# EAGLE design EnsembleSix (EAGLE 7.6.0)
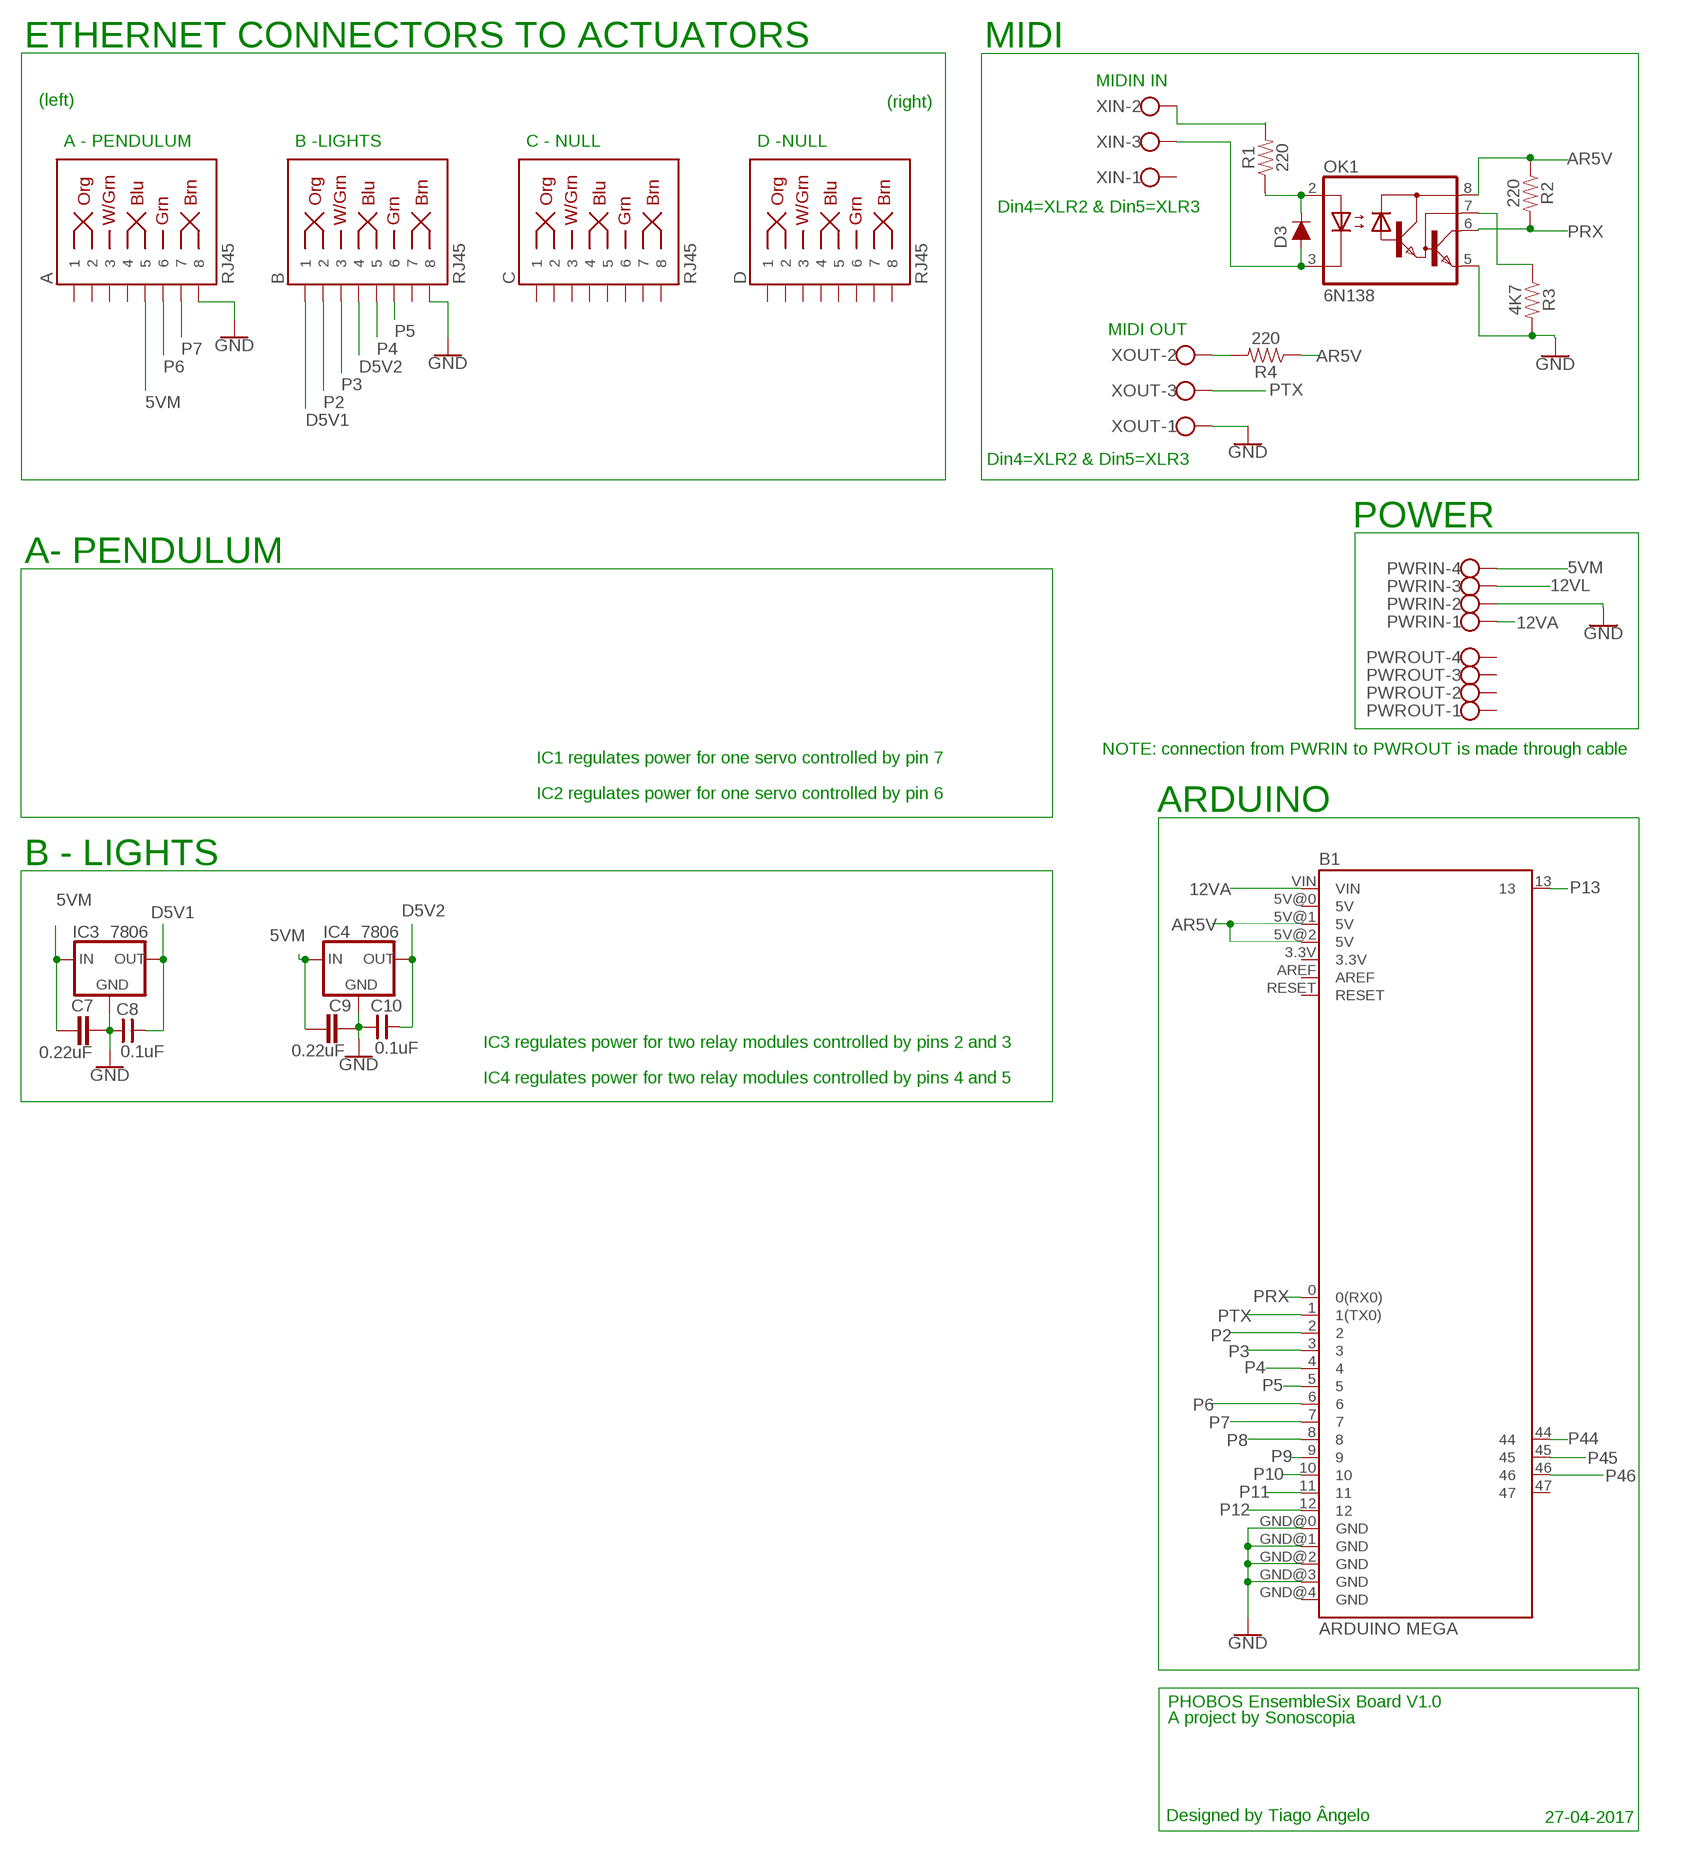
[diagram p0: schematic, sheet 1]

## Parts
A  RJ45  RJ45-8  [RJ45-8]
B  RJ45  RJ45-8  [RJ45-8]
B1  ARDUINO MEGA  ARDUINO_MEGA_R3FULL  [ARDUINO_MEGA]
C  RJ45  RJ45-8  [RJ45-8]
C7  0.22uF  C5/3  [C5B3]
C8  0.1uF  CNP-C025-050X025  [C025-050X025]
C9  0.22uF  C5/3  [C5B3]
C10  0.1uF  CNP-C025-050X025  [C025-050X025]
D  RJ45  RJ45-8  [RJ45-8]
D3  200mA/100V/1V  DIODE-1N4148  [DIODE-1N4148]
IC3  7806  78XXS  [78XXS]
IC4  7806  78XXS  [78XXS]
OK1  6N138  [DIL08]
PWRIN  W237-4  [W237-4]
PWROUT  W237-4  [W237-4]
R1  220  1KOHM-HORIZ-1/4W-5%  [AXIAL-0.3]
R2  220  1KOHM-HORIZ-1/4W-5%  [AXIAL-0.3]
R3  4K7  1KOHM-HORIZ-1/4W-5%  [AXIAL-0.3]
R4  220  1KOHM-HORIZ-1/4W-5%  [AXIAL-0.3]
XIN  W237-103  [W237-103]
XOUT  W237-103  [W237-103]

## Nets
5VM [5VM]: A.5 C7.1 C9.1 IC3.IN IC4.IN PWRIN.4
12VA [12VA]: B1.VIN PWRIN.1
12VL [12VL]: PWRIN.3
AR5V: B1.5V@1(5V) B1.5V@2(5V) OK1.8(VCC) R2.P$1 R4.P$1
D5V1: B.1 C8.2 IC3.OUT
D5V2: B.4 C10.2 IC4.OUT
GND [GND]: A.8 B1.GND@0(GND) B1.GND@1(GND) B1.GND@2(GND) B1.GND@3(GND) B.8 C7.2 C8.1 C9.2 C10.1 IC3.GND IC4.GND OK1.5(GND) PWRIN.2 R3.P$2 XOUT.1
N$2: R4.P$2 XOUT.2
N$25: D3.A OK1.3(C) XIN.3
N$26: D3.C OK1.2(A) R1.P$1
N$27: R1.P$2 XIN.2
N$29: OK1.7(VB) R3.P$1
P2: B1.2 B.2
P3: B1.3 B.3
P4: B1.4 B.5
P5: B1.5 B.6
P6: A.6 B1.6
P7: A.7 B1.7
P8: B1.8
P9: B1.9
P10: B1.10
P11: B1.11
P12: B1.12
P13: B1.13
P44: B1.44
P45: B1.45
P46: B1.46
PRX: B1.0(0(RX0)) OK1.6(VO) R2.P$2
PTX: B1.1(1(TX0)) XOUT.3
Unconnected: A.1 A.2 A.3 A.4 B1.3.3V B1.5V@0(5V) B1.47 B1.AREF B1.GND@4(GND) B1.RESET B.7 C.1 C.2 C.3 C.4 C.5 C.6 C.7 C.8 D.1 D.2 D.3 D.4 D.5 D.6 D.7 D.8 PWROUT.1 PWROUT.2 PWROUT.3 PWROUT.4 XIN.1

## Notes on the sheet
- ETHERNET CONNECTORS TO ACTUATORS | MIDI
- MIDIN IN
- (left) | (right)
- A - PENDULUM | B -LIGHTS | C - NULL | D -NULL
- Din4=XLR2 & Din5=XLR3
- MIDI OUT
- Din4=XLR2 & Din5=XLR3
- POWER
- A- PENDULUM
- NOTE: connection from PWRIN to PWROUT is made through cable
- IC1 regulates power for one servo controlled by pin 7
- IC2 regulates power for one servo controlled by pin 6
- ARDUINO
- B - LIGHTS
- IC3 regulates power for two relay modules controlled by pins 2 and 3
- IC4 regulates power for two relay modules controlled by pins 4 and 5
- PHOBOS EnsembleSix Board V1.0
- A project by Sonoscopia
- Designed by Tiago Ângelo | 27-04-2017

## Library data of the parts
A B C D = SparkFun-Connectors:RJ45-8: RJ45 Jack - 8 pin Simple RJ45, 8-pin connection. Commonly used for Cat5, Cat5e, and Cat6 Ethernet cables. Here is the connector we sell at SparkFun: RJ45 8-Pin Connector <https://www.sparkfun.com/products/643> (PRT-00643) Datasheet <https://cdn.sparkfun.com/datasheets/Prototyping/04908.pdf> It is used on this SparkFun product: SparkFun RJ45 Breakout <https://www.sparkfun.com/products/716> (BOB-00716) Note, you may also be interested in the "MAGJACK" version of this. It is basically a RJ45 connector, but also has some status LEDs built into the connector housing. You can check that out in this library at the device named "MAGJACK.dev" and see these products online: RJ45 Ethernet MagJack-Compatible <https://www.sparkfun.com/products/8534> (PRT-08534) SparkFun RJ45 MagJack Breakout <https://www.sparkfun.com/products/13021> (BOB-13021); PROD_ID: CONN-08506; SF_ID: PRT-00643
B1 = PHOBOS-Boards:ARDUINO_MEGA_R3: Arduino Mega R3 ATmega2560 R3 compatible footprint. SparkFun Products: Arduino Mega 2560 R3 <https://www.sparkfun.com/products/11061>
C7 C9 = capacitor-wima:C: CAPACITOR naming: grid - package width
C8 C10 = cap-master:CNP-: NON-POLARIZED CAP
D3 = SparkFun-DiscreteSemi:DIODE: Diode These are standard reverse protection diodes and small signal diodes. SparkFun Products: SparkFun SparkPunk Sound Kit <https://www.sparkfun.com/products/11177> SparkFun ESP8266 Thing <https://www.sparkfun.com/products/13231>; PROD_ID: DIO-08378
IC3 IC4 = v-reg:78XXS: VOLTAGE REGULATOR
OK1 = optocoupler:6N138: MOTOROLA OPTO COUPLER; MF: VISHAY/TELEFUNKEN; MPN: 6N138; OC_FARNELL: 9860150; OC_NEWARK: 35K5294
PWRIN PWROUT = con-wago-500:W237-4: WAGO SCREW CLAMP; OC_FARNELL: unknown; OC_NEWARK: unknown
R1-R4 = SparkFun-Resistors:1KOHM: 1kΩ resistor A resistor is a passive two-terminal electrical component that implements electrical resistance as a circuit element. Resistors act to reduce current flow, and, at the same time, act to lower voltage levels within circuits. - Wikipedia; PROD_ID: RES-08380; VALUE: 1k
XIN XOUT = con-wago-500:W237-103: WAGO SCREW CLAMP; MPN: 237-103; OC_FARNELL: unknown; OC_NEWARK: 18M7116

## Net classes
0 default: width 0.508 mm, drill 0.508 mm, clearance 0.406 mm
1 GND: width 1.016 mm, drill 0.508 mm, clearance 0.508 mm
2 5VM: width 1.016 mm, drill 0.508 mm, clearance 0.508 mm
3 12VL: width 0.61 mm, drill 0.508 mm, clearance 0.508 mm
4 12VA: width 0.508 mm, drill 0.508 mm, clearance 0.508 mm
5 AR5V: width 0.406 mm, drill 0.508 mm, clearance 0.508 mm
6 PTX: width 0.406 mm, drill 0.508 mm, clearance 0.508 mm
7 PRX: width 0.406 mm, drill 0.508 mm, clearance 0.508 mm

## Board
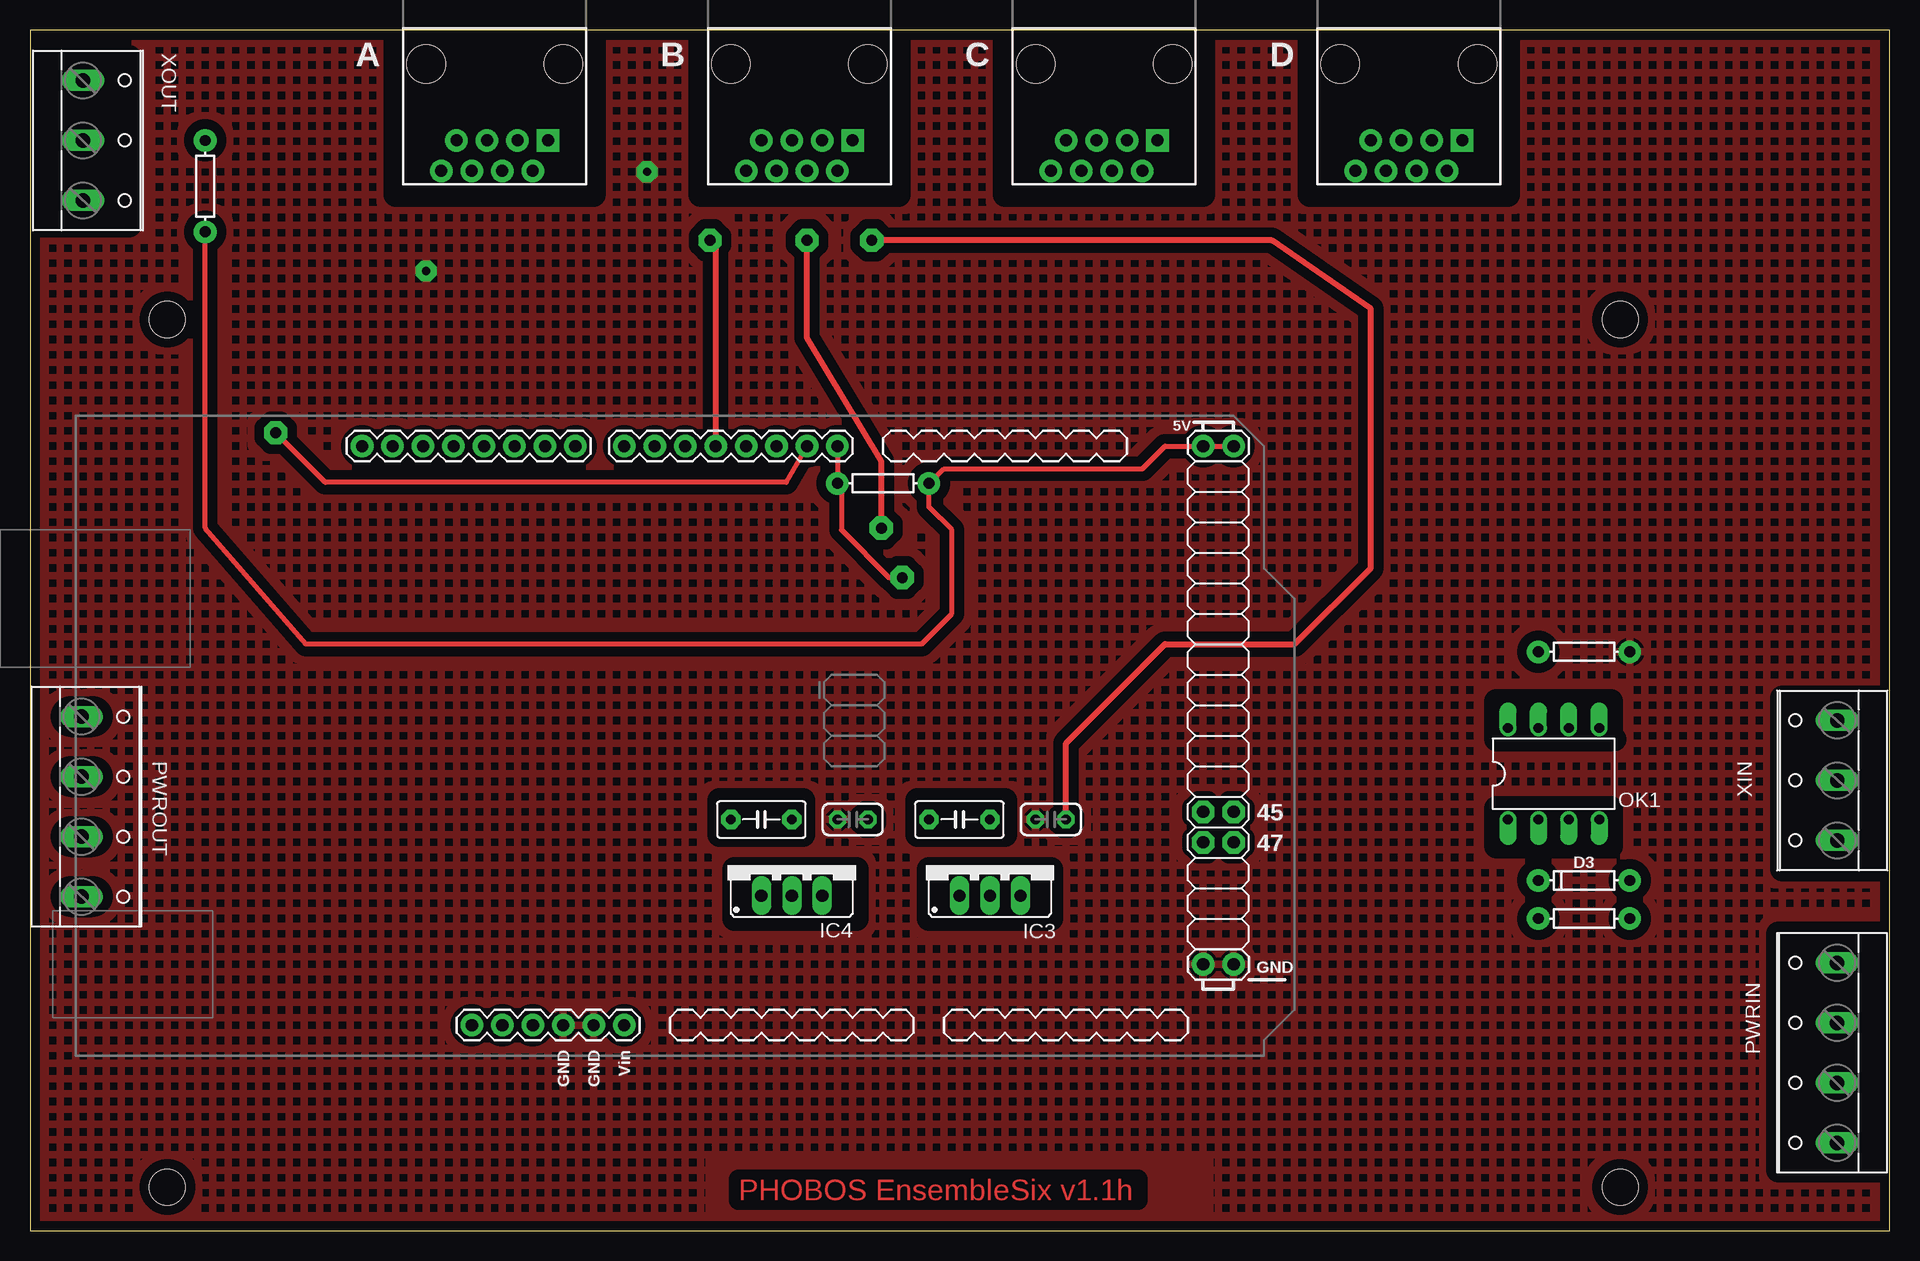
[diagram p1: board, top side]
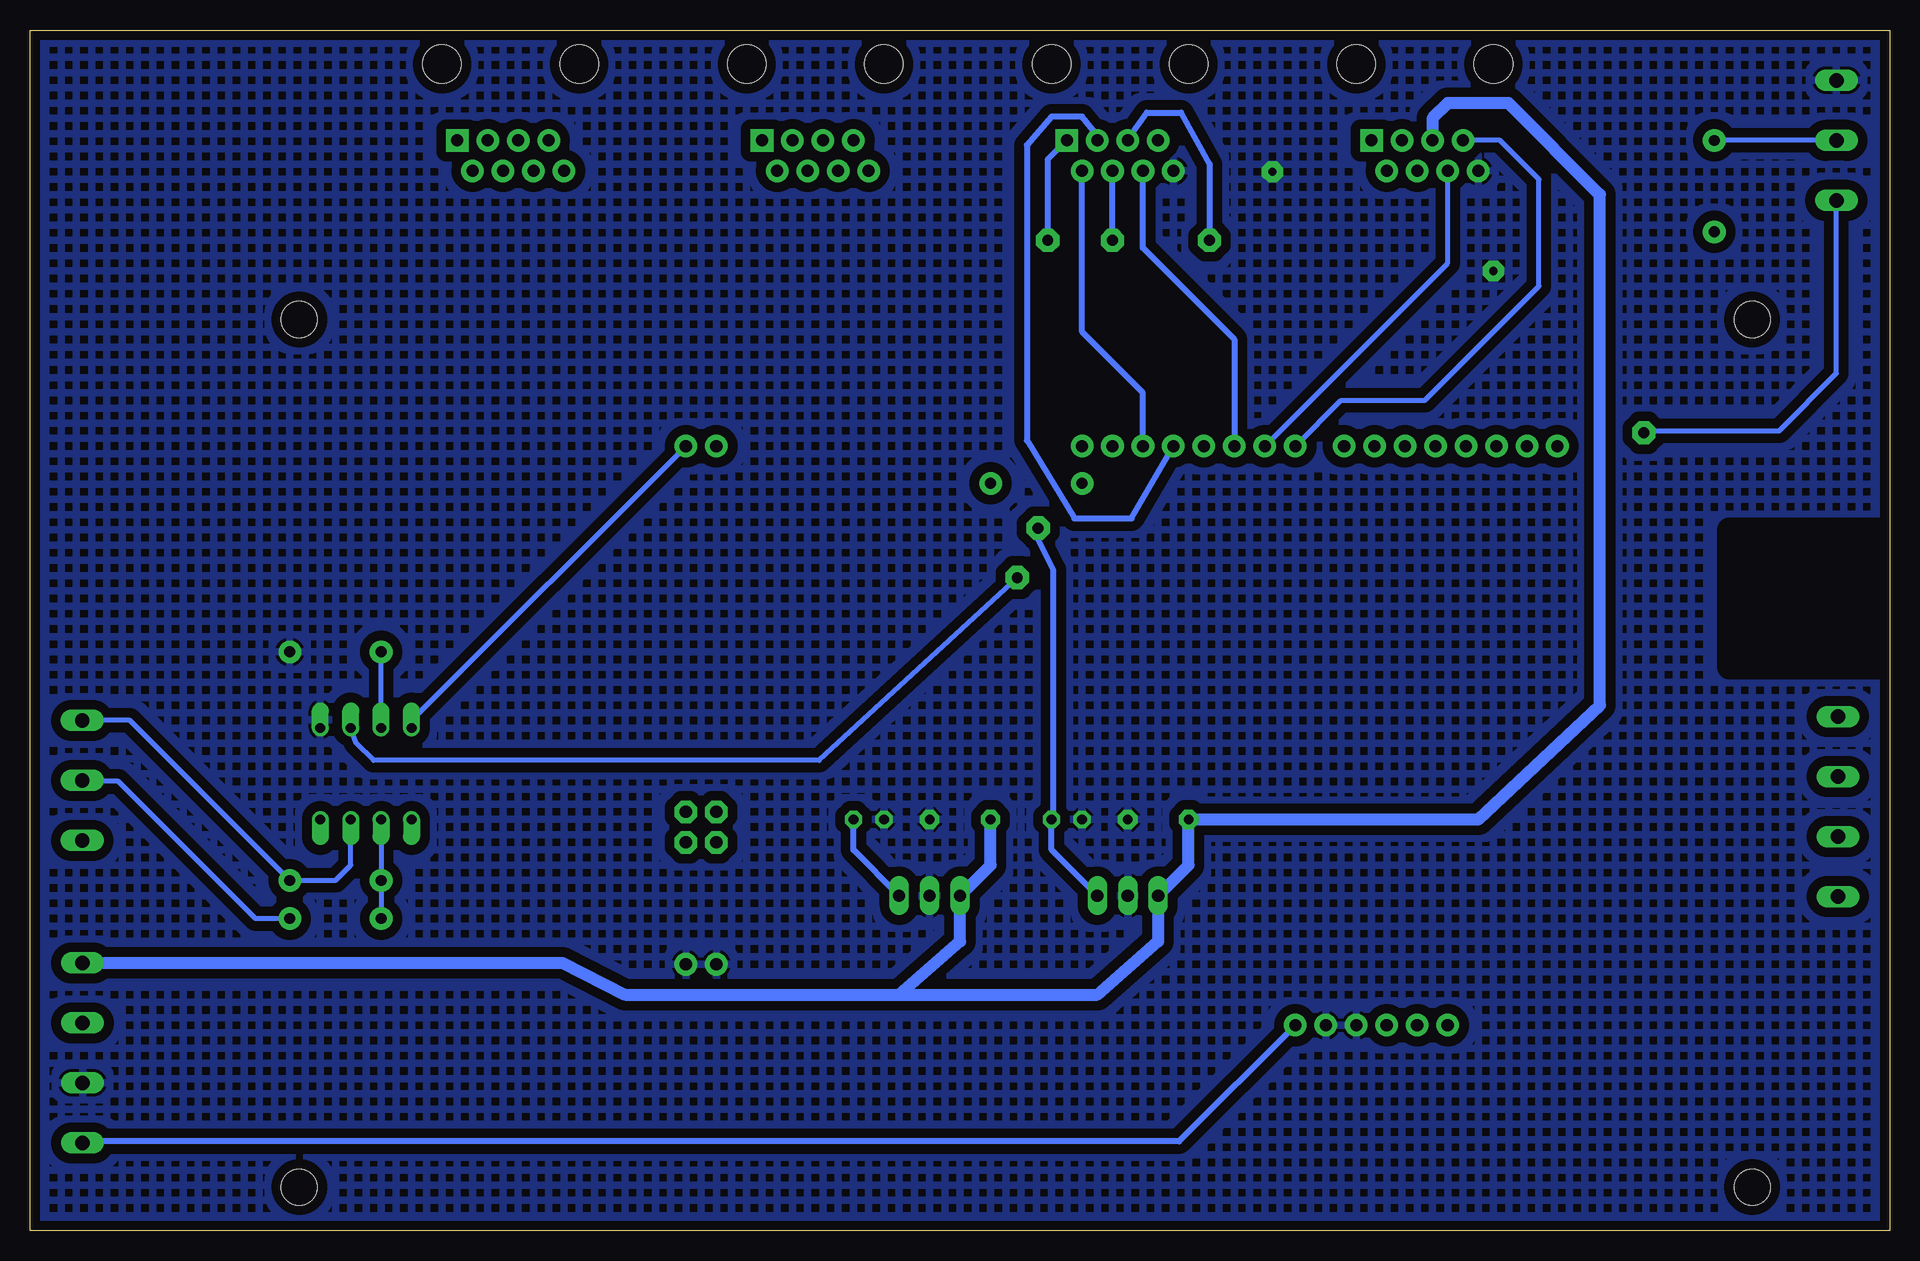
[diagram p2: board, bottom side, seen from below]

Size 155 x 100.08 mm. Coordinates in mm from the lower left corner, seen from the top.
Outline: 0,0 155,0 155,100.08 0,100.08 0,0
Copper layers (1*16): Top 0.035mm / dielectric 1.5mm / Bottom 0.035mm
Design rules "Dek": minimum track width 12mil, minimum drill 36mil, track to track 12mil, track to pad 12mil, pad to pad 12mil, via to via 12mil, smd to smd 0mil, copper to edge 10mil, drill to drill 12mil, minimum pad ring 12mil, minimum via ring 20mil, stop-mask expansion 4mil, vias tented up to drill 25mil, thermal gap 10mil
Holes 3 mm at 132.55,75.95 132.55,3.65 11.45,3.65 11.45,75.95
tRestrict: area 30.5,86.4 to 47,108; area 55.9,86.4 to 72.4,108; area 81.3,86.4 to 97.8,108; area 106.7,86.4 to 123.2,108; area 0,83.8 to 8.3,97.8; area 146.1,30.2 to 154.3,44.5; area 145.7,5.1 to 154.6,24.8; area 122.2,32.1 to 131.8,35.2; area 122.2,41 to 132.1,44.1; area 58.7,26 to 68.9,30.2; area 74.9,26 to 85.1,30.2; area 57.5,33 to 64.5,35.9; 1 more areas
bRestrict: area -2.5,47 to 13.3,58.4
vRestrict: area 71.1,64.1 to 91.4,66.7; area 96.5,36.2 to 101.6,64.1; area 96.5,23.5 to 101.6,31.1; area 53.3,15.9 to 73.7,18.4; area 76.2,15.9 to 96.5,18.4; area -2.5,47 to 13.3,58.4; area 24.8,70.5 to 31.1,72.7; area 42.5,70.5 to 48.9,72.7; area 121.9,35.2 to 132.1,41

### Footprints (pad centres in the part's own frame; a part is rotated, then mirrored left to right if it is on the bottom)
RJ45-8 = drill 1 pad 1.88 square: 1 -4.445,6.35 | drill 1 pad 1.88: 2 -3.175,8.89; 3 -1.905,6.35; 4 -0.635,8.89; 5 0.635,6.35; 6 1.905,8.89; 7 3.175,6.35; 8 4.445,8.89 | hole 3.2: -5.715,0; 5.715,0
ARDUINO_MEGA = drill 1.016 pad 1.88: 0 13.97,24.13; 1 11.43,24.13; 2 8.89,24.13; 3 6.35,24.13; 3.3V -13.97,-24.13; 4 3.81,24.13; 5 1.27,24.13; 5V@0 -11.43,-24.13; 5V@1 44.45,24.13; 5V@2 46.99,24.13; 6 -1.27,24.13; 7 -3.81,24.13; 8 -7.874,24.13; 9 -10.414,24.13; 10 -12.954,24.13; 11 -15.494,24.13; 12 -18.034,24.13; 13 -20.574,24.13; AREF -25.654,24.13; GND@0 -8.89,-24.13; GND@1 -6.35,-24.13; GND@2 44.45,-19.05; GND@3 46.99,-19.05; GND@4 -23.114,24.13; RESET -16.51,-24.13; VIN -3.81,-24.13 | drill 1.016 pad 1.88 octagon: 44 44.45,-6.35; 45 46.99,-6.35; 46 44.45,-8.89; 47 46.99,-8.89
C5B3 = drill 0.813 pad 1.6 octagon: 1 -2.54,0; 2 2.54,0
C025-050X025 = drill 0.813 pad 1.422 octagon: 1 -1.27,0; 2 1.27,0
DIODE-1N4148 = drill 0.9 pad 1.88: A -3.81,0; C 3.81,0
78XXS = drill 1.016 long: GND 0,-2.54; IN -2.54,-2.54; OUT 2.54,-2.54
DIL08 = drill 0.813 offset: 1 -3.81,-3.81; 2 -1.27,-3.81; 3 1.27,-3.81; 4 3.81,-3.81; 5 3.81,3.81; 6 1.27,3.81; 7 -1.27,3.81; 8 -3.81,3.81
W237-4 = drill 1.194 long: 1 -7.5,-1.27; 2 -2.5,-1.27; 3 2.5,-1.27; 4 7.5,-1.27
AXIAL-0.3 = drill 0.9 pad 1.88: P$1 -3.81,0; P$2 3.81,0
W237-103 = drill 1.194 long: 1 -5,-1.29; 2 0,-1.29; 3 5,-1.29

### Placement (x,y rotation side)
A  38.73,97.23 180 top
B  64.13,97.23 180 top
B1  53.34,41.27 0 top
C  89.53,97.23 180 top
C7  77.47,34.29 0 top
C8  85.09,34.29 0 top
C9  60.96,34.29 0 top
C10  68.58,34.29 0 top
D  114.94,97.23 180 top
D3  129.54,29.21 180 top
IC3  80.01,30.48 0 top
IC4  63.5,30.48 0 top
OK1  127,38.1 0 top
PWRIN  149.35,14.84 90 top
PWROUT  5.57,35.36 270 top
R1  129.54,26.04 0 top
R2  71.12,62.3 180 top
R3  129.54,48.26 0 top
R4  14.6,87.07 90 top
XIN  149.35,37.54 90 top
XOUT  5.71,90.88 270 top

### Tracks (layer width: path | path; a pad name or v marks a point on that pad's centre or on a via)
5VM
  Bottom 1.016: C7.1 74.93,30.48 IC3.IN 77.47,24.13 82.55,19.68 | PWRIN.4 110.61,22.34 105.41,19.68 82.55,19.68 | 82.55,19.68 66.04,19.68 60.96,24.13 IC4.IN 58.42,30.48 C9.1 34.29,34.29 24.13,43.81 24.13,86.36 31.75,93.98 36.83,93.98 38.1,92.71 A.5
12VA
  Bottom 0.508: B1.VIN 59.21,7.46 150.5,7.46 PWRIN.1
AR5V
  Top 0.406: B1.5V@2 B1.5V@1 94.62,65.41 92.71,63.5 76.2,63.5 75.09,62.39 R2.P$1 74.93,60.33 76.84,58.42 76.84,51.44 74.29,48.9 23.02,48.9 14.6,58.58 R4.P$1
  Bottom 0.406: OK1.8 123.19,42.55 B1.5V@2
D5V1  (via drill 0.91)
  Top 0.508: C8.2 86.36,40.64 94.62,48.9 105.41,48.9 111.76,55.24 111.76,76.83 103.5,82.55 v70.17,82.55
  Bottom 0.508: IC3.OUT 86.36,31.75 C8.2 | B.1 70.17,89.29 v70.17,82.55
D5V2  (via drill 0.91)
  Top 0.508: v64.77,82.55 64.77,74.45 70.96,64.14 v70.96,58.58
  Bottom 0.508: IC4.OUT 69.85,31.75 C10.2 69.69,34.45 69.69,55.09 70.96,57.63 v70.96,58.58 | v64.77,82.55 B.4
GND  (via drill 0.7)
  other vias: 33.02,80.01 51.43,88.27
  pour Bottom (isolate 0.813, hatched): -5.08,104.14 160.02,104.14 160.02,0 -5.08,0
  pour Top (isolate 0.813, hatched): 0,100.33 154.94,100.33 154.94,0 0,0
N$1
  pour Top (isolate 0.813): 56.51,6.35 98.43,6.35 98.43,0 56.51,0
N$2
  Bottom 0.406: XOUT.2 R4.P$2
N$25
  Bottom 0.406: OK1.3 128.27,30.48 129.54,29.21 D3.A 146.68,42.54 XIN.3
N$26
  Bottom 0.406: OK1.2 D3.C R1.P$1
N$27
  Bottom 0.406: R1.P$2 136.21,26.04 147.64,37.47 150.56,37.47 XIN.2
N$29
  Bottom 0.406: OK1.7 R3.P$1
P2
  Bottom 0.508: 67.31,88.27 B.2 67.31,74.93 62.23,69.85 B1.2
P3
  Bottom 0.508: B1.3 63.18,59.37 67.94,59.37 71.91,65.88 71.91,90.49 69.85,92.87 67.31,92.87 66.04,91.28 B.3
P4  (via drill 0.91)
  Top 0.508: B1.4 57.15,82.07 v56.67,82.55
  Bottom 0.508: v56.67,82.55 56.67,88.9 59.05,93.19 61.91,93.19 63.5,90.96 B.5
P5
  Bottom 0.508: B1.5 54.61,74.3 62.23,81.92 B.6 62.23,88.27
P6
  Bottom 0.406: B1.6 36.83,80.64 A.6
P7
  Bottom 0.406: A.7 32.46,90.88 29.21,87.63 29.21,78.74 38.73,69.22 45.72,69.22 B1.7
PRX  (via drill 0.91)
  Top 0.406: B1.0 R2.P$2 67.47,62.23 67.63,62.07 67.63,58.42 71.6,54.45 v72.71,54.45
  Bottom 0.406: OK1.6 127.79,40.64 126.37,39.21 89.22,39.21 v72.71,54.45
PTX  (via drill 0.91)
  Top 0.406: v20.48,66.52 24.61,62.39 63.02,62.39 B1.1
  Bottom 0.406: v20.48,66.52 20.32,66.67 9.21,66.67 4.43,71.46 XOUT.3

### Text on the board
Top: PHOBOS EnsembleSix v1.1h
tSilk: PENDULUM | NULL | LIGHTS | NULL